# Altium project CY8C4245LQI-BoB.PrjPcb
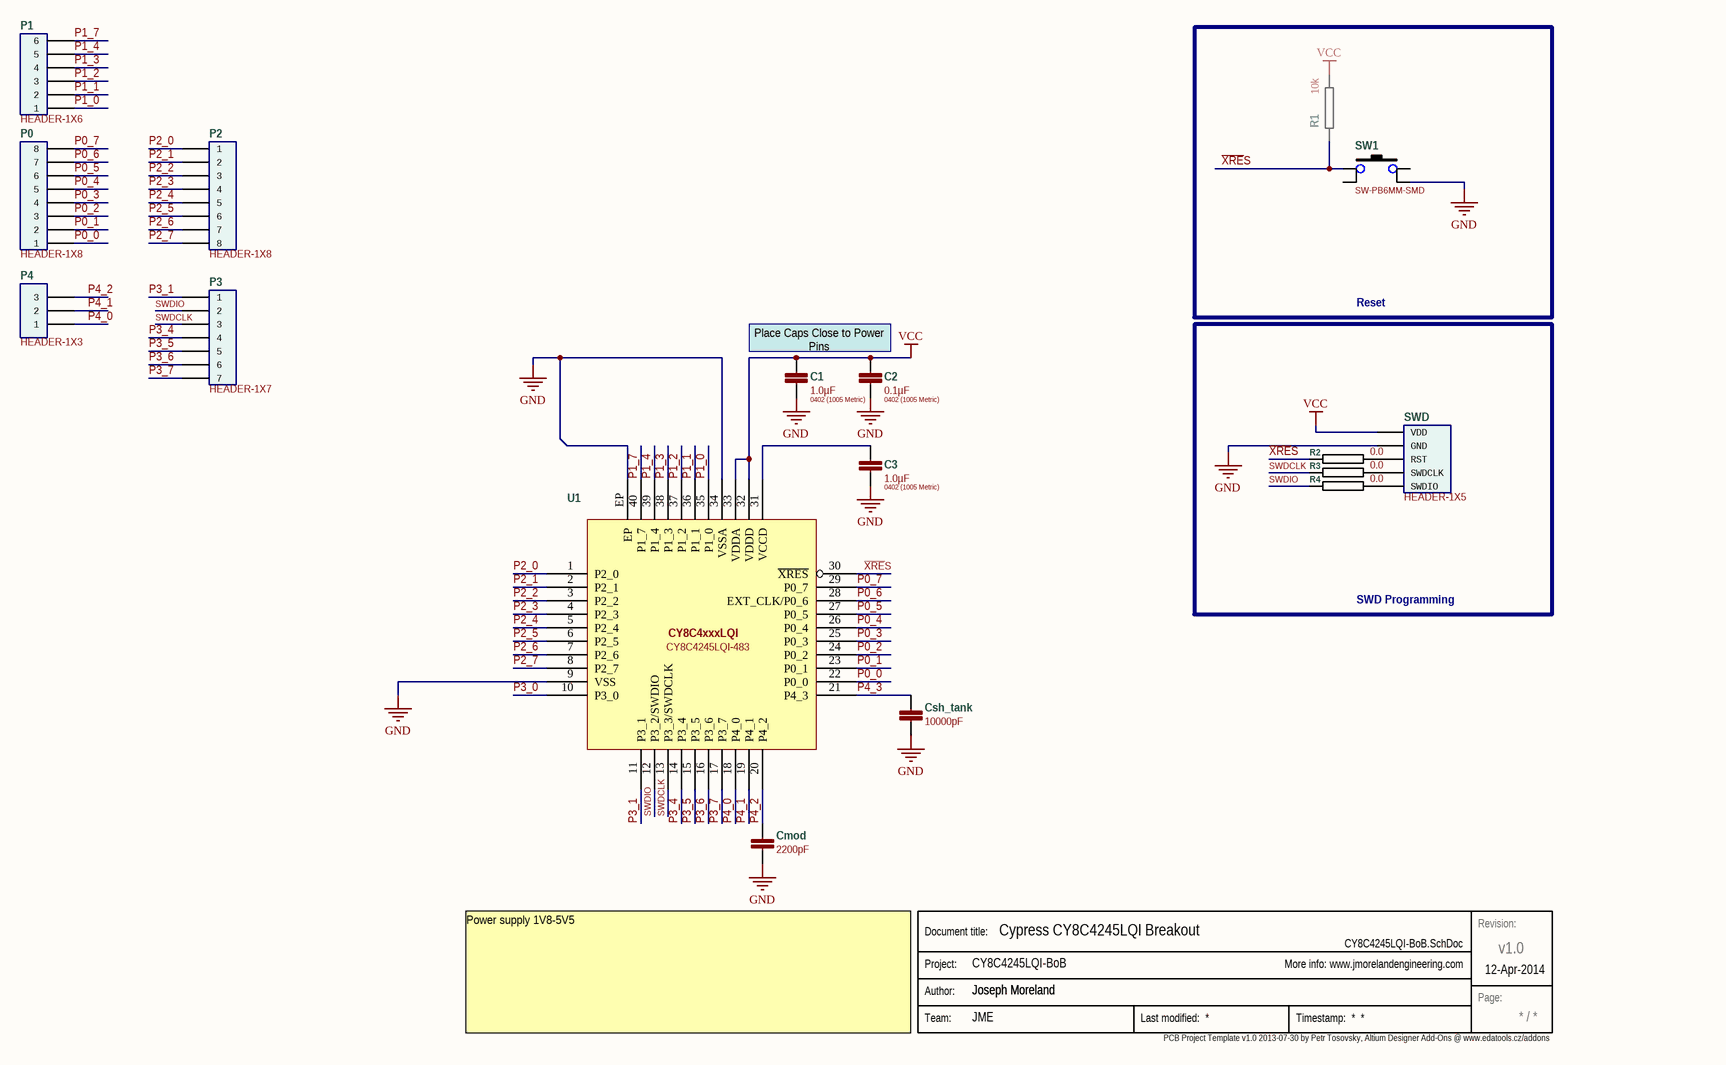
[diagram p0: CY8C4245LQI-BoB.SchDoc]
GlobalProjectLink: www.jmorelandengineering.com; GlobalProjectName: CY8C4245LQI-BoB; GlobalProjectRevision: v1.0; GlobalProjectTeam: JME; GlobalRevisionDate: 12-Apr-2014
1 sheet, 18 parts. Net scope: global (net labels, ports and power ports of the same name join across sheets).
Board file: CY8C4245LQI-BoB.PcbDoc

## Sheet CY8C4245LQI-BoB.SchDoc: Cypress CY8C4245LQI Breakout
size A4; Author: Joseph Moreland; CompanyName: J Moreland Engineering; Engineer: Joseph Moreland; Organization: J Moreland Engineering; ProjectName: CY8C4245LQI

### Parts
C1  1.0µF  Package / Case: 0402 (1005 Metric)  [CAPC1005X06N]
C2  0.1µF  Package / Case: 0402 (1005 Metric)  [CAPC1005X06N]
C3  1.0µF  Package / Case: 0402 (1005 Metric)  [CAPC1005X06N]
Cmod  2200pF  [CAPC1005X06N]
Csh_tank  10000pF  [CAPC1005X06N]
P0  HEADER-1X8  [HEADER-1X8-100MIL]
P1  HEADER-1X6  [HEADER-1X6-100MIL]
P2  HEADER-1X8  [HEADER-1X8-100MIL]
P3  HEADER-1X7  [HEADER-1X7-100MIL]
P4  HEADER-1X3  [HEADER-1X3-100MIL]
R1  10k  [RESC1005X04N]
R2  0.0  [RESC1005X04N]
R3  0.0  [RESC1005X04N]
R4  0.0  [RESC1005X04N]
Stamp  Stamp  (value not drawn)  (graphical)
SW1  SW-PB6MM-SMD  [SW-PB-SMD]
SWD  HEADER-1X5  [HEADER-1X5-100MIL]
U1  CY8C4245LQI-483  [CY8C4xxxLQI]

### Blocks framed on the sheet
Reset: R1 SW1
SWD Programming: R2-R4 SWD

### Nets
GND: C1.2 C2.2 C3.2 Cmod.2 Csh_tank.2 SW1.4 SWD.2(GND) U1.9(VSS) U1.34(VSSA) U1.EP
VCC: C1.1 C2.1 R1.1 SWD.1(VDD) U1.32(VDDD) U1.33(VDDA)
P0_0: P0.1 U1.22(P0_0)
P0_1: P0.2 U1.23(P0_1)
P0_2: P0.3 U1.24(P0_2)
P0_3: P0.4 U1.25(P0_3)
P0_4: P0.5 U1.26(P0_4)
P0_5: P0.6 U1.27(P0_5)
P0_6: P0.7 U1.28(EXT_CLK/P0_6)
P0_7: P0.8 U1.29(P0_7)
P1_0: P1.1 U1.35(P1_0)
P1_1: P1.2 U1.36(P1_1)
P1_2: P1.3 U1.37(P1_2)
P1_3: P1.4 U1.38(P1_3)
P1_4: P1.5 U1.39(P1_4)
P1_7: P1.6 U1.40(P1_7)
P2_0: P2.1 U1.1(P2_0)
P2_1: P2.2 U1.2(P2_1)
P2_2: P2.3 U1.3(P2_2)
P2_3: P2.4 U1.4(P2_3)
P2_4: P2.5 U1.5(P2_4)
P2_5: P2.6 U1.6(P2_5)
P2_6: P2.7 U1.7(P2_6)
P2_7: P2.8 U1.8(P2_7)
P3_0: U1.10(P3_0)
P3_1: P3.1 U1.11(P3_1)
P3_4: P3.4 U1.14(P3_4)
P3_5: P3.5 U1.15(P3_5)
P3_6: P3.6 U1.16(P3_6)
P3_7: P3.7 U1.17(P3_7)
P4_0: P4.1 U1.18(P4_0)
P4_1: P4.2 U1.19(P4_1)
P4_2: Cmod.1 P4.3 U1.20(P4_2)
P4_3: Csh_tank.1 U1.21(P4_3)
SWDCLK: P3.3 R3.2 U1.13(P3_3/SWDCLK)
SWDIO: P3.2 R4.2 U1.12(P3_2/SWDIO)
~{XRE}S: R1.2 R2.2 SW1.1 U1.30(~{XRES})
NetC3_1: C3.1 U1.31(VCCD)
NetR2_1: R2.1 SWD.3(RST)
NetR3_1: R3.1 SWD.4(SWDCLK)
NetR4_1: R4.1 SWD.5(SWDIO)

Not connected (* = marked no-connect by the designer): SW1 2 3

### Notes on the sheet
- Place Caps Close to Power Pins
  VCCD, VDDA
- (near Stamp) Power supply 1V8-5V5
- PCB Project Template v1.0 2013-07-30 by Petr Tosovsky, Altium Designer Add-Ons @ www.edatools.cz/addons <http://www.edatools.cz/addons>
- (in symbol CY8C4245LQI) CY8C4xxxLQI
- (in symbol Stamp) Revision:; Document title:; Project:; Author:; Page:; Team:

### Library data of the parts
C1 C3 = C0402C105K8PACTU: CAP CER 1UF 10V 10% X5R 0402; Manufacturer: Kemet; Supplier 1: Digi-Key; Manufacturer Part Number: C0402C105K8PACTU; RoHS: RoHS Compliant; PartDescription: CAP CER 1UF 10V 10% X5R 0402; Category: Capacitors; Stock 1: 55600; Pricing: 1=0.24, 10=0.204, 25=0.1404, 50=0.1148, 100=0.102, 250=0.07652, 1000=0.05875, 2500=0.0525, 5000=0.04875 (USD); Packaging: Cut Tape (CT); Capacitance: 1.0µF; Voltage - Rated: 10V; Tolerance: ±10%; Temperature Coefficient: X5R; Mounting Type: Surface Mount, MLCC; Operating Temperature: -55°C ~ 85°C; Applications: General Purpose; Ratings: -; Size / Dimension: 0.039" L x 0.020" W (1.00mm x 0.50mm); Height - Seated (Max): -; Thickness (Max): 0.022" (0.55mm); Lead Spacing: -; Features: -; Lead Style: -; ComponentLink1URL: http://www.kemet.com/datasheets&C0402C105K8PACTU; ComponentLink1Description: http://www.kemet.com/datasheets&C0402C105K8PACTU; Supplier Part Number 1: 399-7765-1-ND
C2 = C0402C104K9RACTU: CAP CER 0.1UF 6.3V 10% X7R 0402; Manufacturer: Kemet; Supplier 1: Digi-Key; Supplier Part Number 1: 399-4872-2-ND; RoHS: RoHS Compliant; Packaging: Tape & Reel (TR); Capacitance: 0.1µF; Voltage - Rated: 6.3V; Tolerance: ±10%; Temperature Coefficient: X7R; Mounting Type: Surface Mount, MLCC; Operating Temperature: -55°C ~ 125°C; Applications: General Purpose; Ratings: -; Size / Dimension: 0.039" L x 0.020" W (1.00mm x 0.50mm); Height - Seated (Max): -; Thickness (Max): 0.022" (0.55mm); Lead Spacing: -; Features: -; Lead Style: -; ComponentLink1URL: http://www.kemet.com/datasheets&C0402C104K9RACTU; ComponentLink1Description: http://www.kemet.com/datasheets&C0402C104K9RACTU; Category: Capacitors; Stock 1: 230000; Pricing: 10000=0.00945, 20000=0.009, 30000=0.00855, 50000=0.00765, 100000=0.00619 (USD); ManufacturerPartNumber: C0402C104K9RACTU; PartDescription: CAP CER 0.1UF 6.3V 10% X7R 0402
Cmod = C0402C222K4RACTU: CAP CER 2200PF 16V 10% X7R 0402; Manufacturer: Kemet; Supplier 1: Digi-Key; Supplier Part Number 1: 399-7778-2-ND; RoHS: RoHS Compliant; Packaging: Tape & Reel (TR); Capacitance: 2200pF; Voltage - Rated: 16V; Tolerance: ±10%; Temperature Coefficient: X7R; Mounting Type: Surface Mount, MLCC; Operating Temperature: -55°C ~ 125°C; Applications: General Purpose; Ratings: -; Package / Case: 0402 (1005 Metric); Size / Dimension: 0.039" L x 0.020" W (1.00mm x 0.50mm); Height - Seated (Max): -; Thickness (Max): 0.022" (0.55mm); Lead Spacing: -; Features: -; Lead Style: -; ComponentLink1URL: http://www.kemet.com/datasheets&C0402C222K4RACTU; ComponentLink1Description: http://www.kemet.com/datasheets&C0402C222K4RACTU; Category: Capacitors; Stock 1: 20000; Pricing: 10000=0.06475, 20000=0.06142, 30000=0.0592, 50000=0.0555, 100000=0.04903 (USD); ManufacturerPartNumber: C0402C222K4RACTU; PartDescription: CAP CER 2200PF 16V 10% X7R 0402
Csh_tank = C0402C103K4RACTU: CAP CER 10000PF 16V 10% X7R 0402; Manufacturer: Kemet; Supplier 1: Digi-Key; Manufacturer Part Number: C0402C103K4RACTU; RoHS: RoHS Compliant; PartDescription: CAP CER 10000PF 16V 10% X7R 0402; Category: Capacitors; Stock 1: 219113; Pricing: 1=0.1, 10=0.02, 25=0.014, 50=0.0106, 100=0.009, 250=0.00736, 1000=0.0048, 2500=0.00432, 5000=0.004 (USD); Packaging: Cut Tape (CT); Capacitance: 10000pF; Voltage - Rated: 16V; Tolerance: ±10%; Temperature Coefficient: X7R; Mounting Type: Surface Mount, MLCC; Operating Temperature: -55°C ~ 125°C; Applications: General Purpose; Ratings: -; Package / Case: 0402 (1005 Metric); Size / Dimension: 0.039" L x 0.020" W (1.00mm x 0.50mm); Height - Seated (Max): -; Thickness (Max): 0.022" (0.55mm); Lead Spacing: -; Features: -; Lead Style: -; ComponentLink1URL: http://www.kemet.com/datasheets&C0402C103K4RACTU; ComponentLink1Description: http://www.kemet.com/datasheets&C0402C103K4RACTU; Supplier Part Number 1: 399-1038-1-ND
P0 P2 = HEADER-1X8-100MIL
P1 = HEADER-1X6-100MIL
P3 = HEADER-1X7-100MIL
P4 = HEADER-1X3-100MIL
R1 = CRCW040210K0FKED: RES 10.0K OHM 1/16W 1% 0402 SMD; MANUFACTURER_NAME: Vishay-Dale; Manufacturer: Vishay Dale; POWER: 0.063; TOLERANCE: 1.0; Power (Watts): 0.063W, 1/16W; Temperature Coefficient: ±100ppm/°C; MANUFACTURER_PART_NUMBER: CRCW040210K0FKED; Resistance: 10k; VENDOR: Vishay-Dale; Supplier 1: Digi-Key; Supplier Part Number 1: 541-10.0KLCT-ND; Manufacturer Part Number: CRCW040210K0FKED; RoHS: RoHS Compliant; PartDescription: RES 10.0K OHM 1/16W 1% 0402 SMD; Category: Resistors; Stock: 736156; Pricing: 10=0.083, 50=0.0444, 200=0.0255, 1000=0.0174 (USD); Packaging: Cut Tape (CT); Composition: Thick Film; Features: Automotive AEC-Q200 Qualified; Package / Case: 0402 (1005 Metric); Supplier Device Package: 0402 (1005 Metric); Size / Dimension: 0.039" L x 0.020" W (1.00mm x 0.50mm); Height: 0.016" (0.40mm); Number of Terminations: 2; ComponentLink1URL: http://www.vishay.com/doc?20035; ComponentLink1Description: http://www.vishay.com/doc?20035
R2-R4 = CRCW04020000Z0ED: RES 0.0 OHM 1/16W JUMP 0402 SMD; Manufacturer: Vishay Dale; Tolerance: Jumper; Power (Watts): 0.063W, 1/16W; Supplier 1: Digi-Key; Manufacturer Part Number: CRCW04020000Z0ED; RoHS: RoHS Compliant; PartDescription: RES 0.0 OHM 1/16W JUMP 0402 SMD; Category: Resistors; Stock 1: 2021837; Pricing: 10=0.074, 50=0.04, 200=0.02295, 1000=0.01566 (USD); Packaging: Cut Tape (CT); Resistance: 0.0; Composition: Thick Film; Features: Automotive AEC-Q200 Qualified; Temperature Coefficient: -; Package / Case: 0402 (1005 Metric); Supplier Device Package: 0402 (1005 Metric); Size / Dimension: 0.039" L x 0.020" W (1.00mm x 0.50mm); Height: 0.016" (0.40mm); Number of Terminations: 2; ComponentLink1URL: http://www.vishay.com/doc?20035; ComponentLink1Description: http://www.vishay.com/doc?20035; Supplier Part Number 1: 541-0.0JCT-ND
SW1 = SW-PB6MM-SMD: PUSHBUTTON SWITCH 6MM SMD
SWD = CONN-1X5-100MIL-SWD-MiniProg
U1 = CY8C4245LQI: PSOC4 IC MCU 32BIT 32KB FLASH 40QFN; Manufacturer: Cypress Semiconductor Corp; Core Processor: ARM® Cortex™-M0; Core Size: 32-Bit; Speed: 48MHz; Connectivity: I²C, IrDA, LIN, Microwire, SmartCard, SPI, SSP, UART/USART; Peripherals: Brown-out Detect/Reset, CapSense, LCD, LVD, POR, PWM, WDT; Number of I /O: 34; Program Memory Size: 32KB (32K x 8); RAM Size: 4K x 8; Voltage - Supply (Vcc/Vdd): 1.71 V ~ 5.5 V; Data Converters: A/D 8x12b; Oscillator Type: Internal; Supplier 1: Digi-Key; Supplier Part Number 1: CY8C4245LQI-483-ND; RoHS: RoHS Compliant; Category: Integrated Circuits (ICs); Pricing: 1=3.37, 25=2.9072, 100=2.754, 250=2.295, 500=2.2185, 750=2.142, 1000=2.0655, 2500=1.989 (USD); Packaging: Tray; Program Memory Type: FLASH; EEPROM Size: -; Operating Temperature: -40°C ~ 85°C; Package / Case: 40-UFQFN Exposed Pad; ComponentLink1URL: http://www.cypress.com/?docID=46322; ComponentLink1Description: http://www.cypress.com/?docID=46322; PartDescription: IC MCU 32BIT 32KB FLASH 40QFN; Stock 1: 400; ManufacturerPartNumber: CY8C4245LQI-483